# Altium schematic sheet PCB_热插拔CSPS电源背板_ESP32.schdoc
size A4
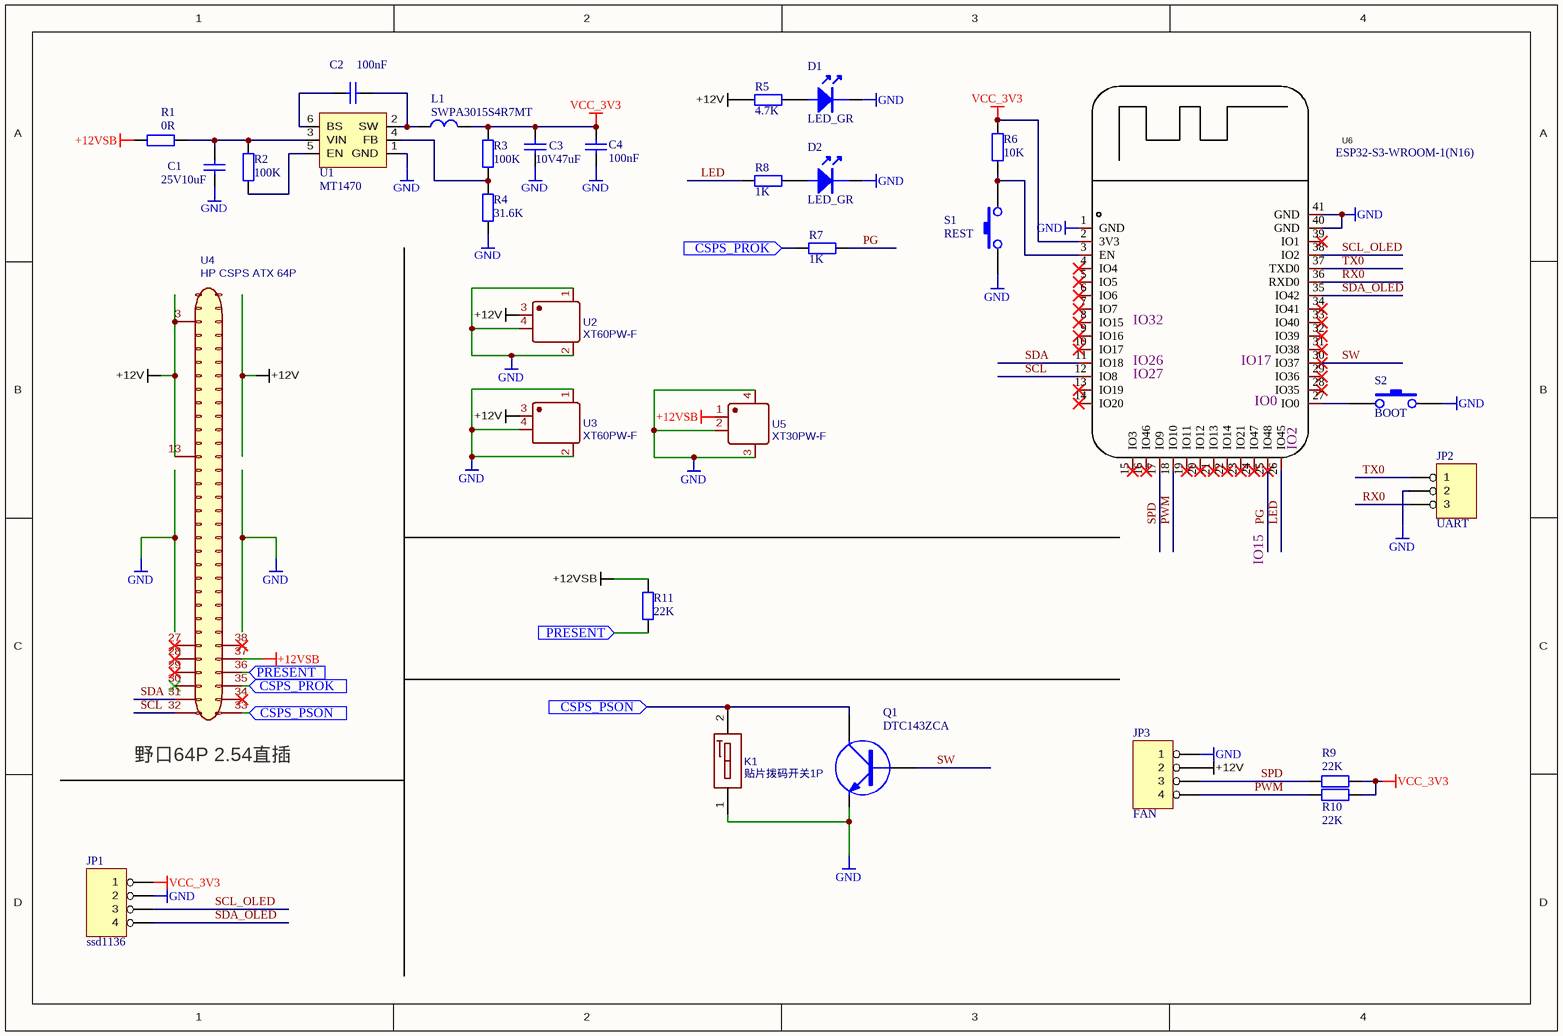
[diagram p0: PCB_热插拔CSPS电源背板_ESP32.schdoc]

## Parts
C1  25V10uF  [1206C]
C2  100nF  [0603C]
C3  10V47uF  [1206C]
C4  100nF  [0603C]
D1  LED_GR  [LED-SMD-0603]
D2  LED_GR  [LED-SMD-0603]
JP1  ssd1136  [SIP4]
JP2  UART  [SIP3]
JP3  FAN  [PH2.0-4AW]
K1  贴片拨码开关1P  [贴片拨码开关1P]
L1  SWPA3015S4R7MT  [COKE_3X3A]
Q1  DTC143ZCA  [SOT23]
R1  0R  [0603R]
R2  100K  [0603R]
R3  100K  [0603R]
R4  31.6K  [0603R]
R5  4.7K  [0603R]
R6  10K  [0603R]
R7  1K  [0603R]
R8  1K  [0603R]
R9  22K  [0603R]
R10  22K  [0603R]
R11  22K  [0603R]
S1  REST  [KEY-3.6X6]
S2  BOOT  [KEY-3.6X6]
U1  MT1470  [SOT23-6]
U2  XT60PW-F  [TH_2P-XT60PW-F]
U3  XT60PW-F  [TH_2P-XT60PW-F]
U4  HP CSPS ATX 64P  [ATX 64P HP 野口64P直插]
U5  XT30PW-F  [CONN-TH_XT30PW-F]
U6  ESP32-S3-WROOM-1(N16)  [WIRELM-SMD_ESP32-S3-WROOM-1]

## Ports
CSPS_PROK (in), CSPS_PSON (in), PRESENT (in)

## Nets
+12V: JP3.2 R5.2 U2.3 U3.3 U4.3(Pin_3) U4.13(Pin_13)
+12VSB: R1.2 R11.1 U4.37(+12VSB) U5.1
GND: C1.2 C3.2 C4.1 D1.2 D2.2 JP1.2 JP2.2 JP3.1 K1.1(A1) Q1.2(E) R4.1 S1.1 S2.2 U1.1(GND) U2.1 U2.2 U2.4 U3.1 U3.2 U3.4 U5.2 U5.3 U5.4 U6.1(GND) U6.40(GND) U6.41(GND)
VCC_3V3: C3.1 C4.2 JP1.1 L1.2 R3.2 R6.1 R9.2 R10.2 U6.2(3V3)
CSPS_PROK: R7.2 U4.35(I2C-GND) ; port CSPS_PROK
CSPS_PSON: K1.2(B1) Q1.3(C) U4.33(scl) ; port CSPS_PSON
LED: R8.2 U6.26(IO45)
PG: R7.1 U6.25(IO48)
PRESENT: R11.2 U4.36(PRESENT) ; port PRESENT
PWM: JP3.4 R10.1 U6.18(IO10)
RX0: JP2.3 U6.36(RXD0)
SCL: U4.32(CSPS-PSON) U6.12(IO8)
SCL_OLED: JP1.3 U6.38(IO2)
SDA: U4.31(Pin_31) U6.11(IO18)
SDA_OLED: JP1.4 U6.35(IO42)
SPD: JP3.3 R9.1 U6.17(IO9)
SW: Q1.1(B) U6.30(IO37)
TX0: JP2.1 U6.37(TXD0)
NetC1_1: C1.1 R1.1 R2.2 U1.3(VIN)
NetC2_1: C2.1 U1.6(BS)
NetC2_2: C2.2 L1.1 U1.2(SW)
NetD1_1: D1.1 R5.1
NetD2_1: D2.1 R8.1
NetR2_1: R2.1 U1.5(EN)
NetR3_1: R3.1 R4.2 U1.4(FB)
NetR6_2: R6.2 S1.2 U6.3(EN)
NetS2_1: S2.1 U6.27(IO0)

Not connected (* = marked no-connect by the designer): U4 27(PWOK)* 28(+12VSB)* 29(PRESENT)* 30(CSPS-PSOK)* 34(sda)* 38(pin_38)*; U6 4(IO4)* 5(IO5)* 6(IO6)* 7(IO7)* 8(IO15)* 9(IO16)* 10(IO17)* 13(IO19)* 14(IO20)* 15(IO3)* 16(IO46)* 19(IO11)* 20(IO12)* 21(IO13)* 22(IO14)* 23(IO21)* 24(IO47)* 28(IO35)* 29(IO36)* 31(IO38)* 32(IO39)* 33(IO40)* 34(IO41)* 39(IO1)*

## Notes on the sheet
- (near U6) IO26
- (near U6) IO27
- (near U6) IO32
- (near U6) IO17
- (near U6) IO0
- (near U6) IO2
- IO15
- (near U4) 野口64P 2.54直插

## Library data of the parts
C1-C4 = Cap: Capacitor
D1 D2 = LED
JP1 JP3 = HEADER4
JP2 = HEADER 3
K1 = 贴片拨码开关1P: Contributor: HalfSweet; spicePre: K; spiceSymbolName: 贴片拨码开关1P
L1 = INDUCTOR
Q1 = NPN: NPN Transistor
R1-R11 = Res2: Resistor
S1 S2 = SW-PB
U2 U3 = XT60PW-F: BOM_Manufacturer: null; BOM_Manufacturer Part: XT60PW-F 母头 板插卧式; Contributor: LCSC; BOM_Supplier: LCSC; BOM_Supplier Part: C9900000737; BOM_JLCPCB Part Class: Extended Part; spicePre: U; spiceSymbolName: XT60PW-F
U4 = HP CSPS ATX 64P: Contributor: chaoser; spicePre: U; spiceSymbolName: HP CSPS ATX 64P
U5 = XT30PW-F: BOM_Manufacturer: null; Contributor: LCSC; BOM_Supplier: LCSC; BOM_Supplier Part: C2913282; BOM_Manufacturer Part: XT30PW-F; BOM_JLCPCB Part Class: Extended Part; spicePre: U; spiceSymbolName: XT30PW-F
U6 = ESP32-S3-WROOM-1(N16): Designer: U?; Symbol: ESP32-S3-WROOM-1(N16); Device: ESP32-S3-WROOM-1(N16)